# Altium schematic sheet PSU.Schematic.SchDoc
size A
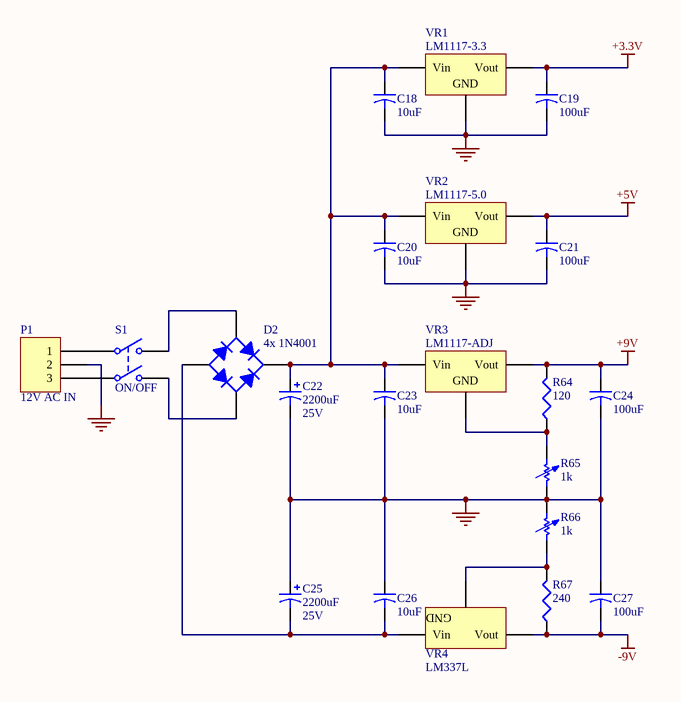
[diagram p0: PSU.Schematic.SchDoc]

## Parts
C18  10uF  [CAPR5-4X5]
C19  100uF  [CAPR5-4X5]
C20  10uF  [CAPR5-4X5]
C21  100uF  [CAPR5-4X5]
C22  2200uF  value 25V  [RB7.6-15]
C23  10uF  [CAPR5-4X5]
C24  100uF  [CAPR5-4X5]
C25  2200uF  value 25V  [RB7.6-15]
C26  10uF  [CAPR5-4X5]
C27  100uF  [CAPR5-4X5]
D2  4x 1N4001  [D-38]
P1  12V AC IN  [HDR1X3]
R64  120  [J1-0603]
R65  1k  [AXIAL-0.7]
R66  1k  [AXIAL-0.7]
R67  240  [J1-0603]
S1  ON/OFF  [DPST-4]
VR1  LM1117-3.3  [D2PAK_N]
VR2  LM1117-5.0  [D2PAK_N]
VR3  LM1117-ADJ  [D2PAK_N]
VR4  LM337L  [D2PAK_N]

## Nets
+3.3V: C19.1 VR1.3(Vout)
+5V: C21.1 VR2.3(Vout)
+9V: C24.1 R64.2 VR3.3(Vout)
-9V: C27.2 R67.1 VR4.3(Vout)
GND: C18.2 C19.2 C20.2 C21.2 C22.2 C23.2 C24.2 C25.1 C26.1 C27.1 P1.2 R65.1 R66.2 VR1.2(GND) VR2.2(GND)
NetC18_1: C18.1 C20.1 C22.1 C23.1 D2.1(K) VR1.1(Vin) VR2.1(Vin) VR3.1(Vin)
NetC25_2: C25.2 C26.2 D2.3(A) VR4.1(Vin)
NetD2_2: D2.2(C) S1.4(NO2)
NetD2_4: D2.4(C) S1.2(NO1)
NetP1_1: P1.1 S1.1(COMMON1)
NetP1_3: P1.3 S1.3(COMMON2)
NetR64_1: R64.1 R65.2 VR3.2(ADJ)
NetR66_1: R66.1 R67.2 VR4.2(ADJ)

## Notes on the sheet
- (in symbol Volt Reg) GND

## Library data of the parts
C18 C20 C23 C26 = Cap2: Capacitor; Value: 10u; Published: 23-Sep-2002; PackageReference: CAPR5-4X5; Publisher: Altium Limited; PackageDescription: Capacitor; 2 Leads
C19 C21 C24 C27 = Cap2: Capacitor; Value: 100u; Published: 23-Sep-2002; PackageReference: CAPR5-4X5; Publisher: Altium Limited; PackageDescription: Capacitor; 2 Leads
C22 C25 = Cap Pol1: Polarized Capacitor (Radial); Published: 8-Jun-2000; LatestRevisionDate: 17-Jul-2002; LatestRevisionNote: Re-released for DXP Platform.; PackageReference: RB7.6-15; Publisher: Altium Limited; PackageDescription: Polarized Capacitor (Radial); 2 Leads
D2 = Bridge1: Full Wave Diode Bridge; Published: 8-Jun-2000; LatestRevisionDate: 29-May-2009; LatestRevisionNote: Sch pins A & K swapped.; DatasheetVersion: E2732B; PackageReference: D-38; Publisher: Altium Limited; PackageDescription: Bridge Rectifier; 4 Terminals; Body 9.4 x 9.4 mm (typ); Pitch 5.08 mm
P1 = Header 3: Header, 3-Pin; LatestRevisionDate: 17-Jul-2002; LatestRevisionNote: Re-released for DXP Platform.; Publisher: Altium Limited
R64 R67 = Res3: Resistor; Published: 8-Jun-2000; LatestRevisionDate: 29-May-2009; LatestRevisionNote: IPC-7351 Footprint Added.; PackageReference: J1-0603; Publisher: Altium Limited; PackageDescription: Chip Resistor
  R64: Value: 120
  R67: Value: 240
R65 R66 = Res Adj1: Variable Resistor; Set Position: 0.5; Published: 8-Jun-2000; LatestRevisionDate: 17-Jul-2002; LatestRevisionNote: Re-released for DXP Platform.; PackageReference: AXIAL-0.7; Publisher: Altium Limited; PackageDescription: Axial Device, Thru-Hole; 2 Leads; 0.7 in Pin Spacing; Value: 1K
S1 = SW-DPST: Double-Pole, Single-Throw Switch; Published: 24-Mar-1999; LatestRevisionDate: 17-Jul-2002; LatestRevisionNote: Re-released for DXP Platform.; PackageReference: DPST-4; Publisher: Altium Limited; PackageDescription: Switch; 4 Leads
VR1-VR4 = Volt Reg: Voltage Regulator; Published: 24-Mar-1999; LatestRevisionDate: 29-May-2009; LatestRevisionNote: IPC-7351 Footprint Added.; PackageReference: D2PAK; Publisher: Altium Limited; PackageDescription: 3-Pin Transistor Outline Package 2.54 mm Pitch, 15.1 mm Lead Span